# EasyEDA Pro project ProProject_SIMPLESLIME_ESP32_v2_2024-06-12-clean.epro

# Schematic Schematic1
Create Date: 2023-09-22; Page Name: P1; Project Name: SIMPLESLIME_ESP32_v2; Schematic Name: Schematic1; Update Date: 2024-02-03; Company: EasyEDA.com; Drawed: EasyEDA Pro; Page Size: A4; Part Number: JLCPCB-002; Reviewed: EasyEDA Pro; Version: V0.1
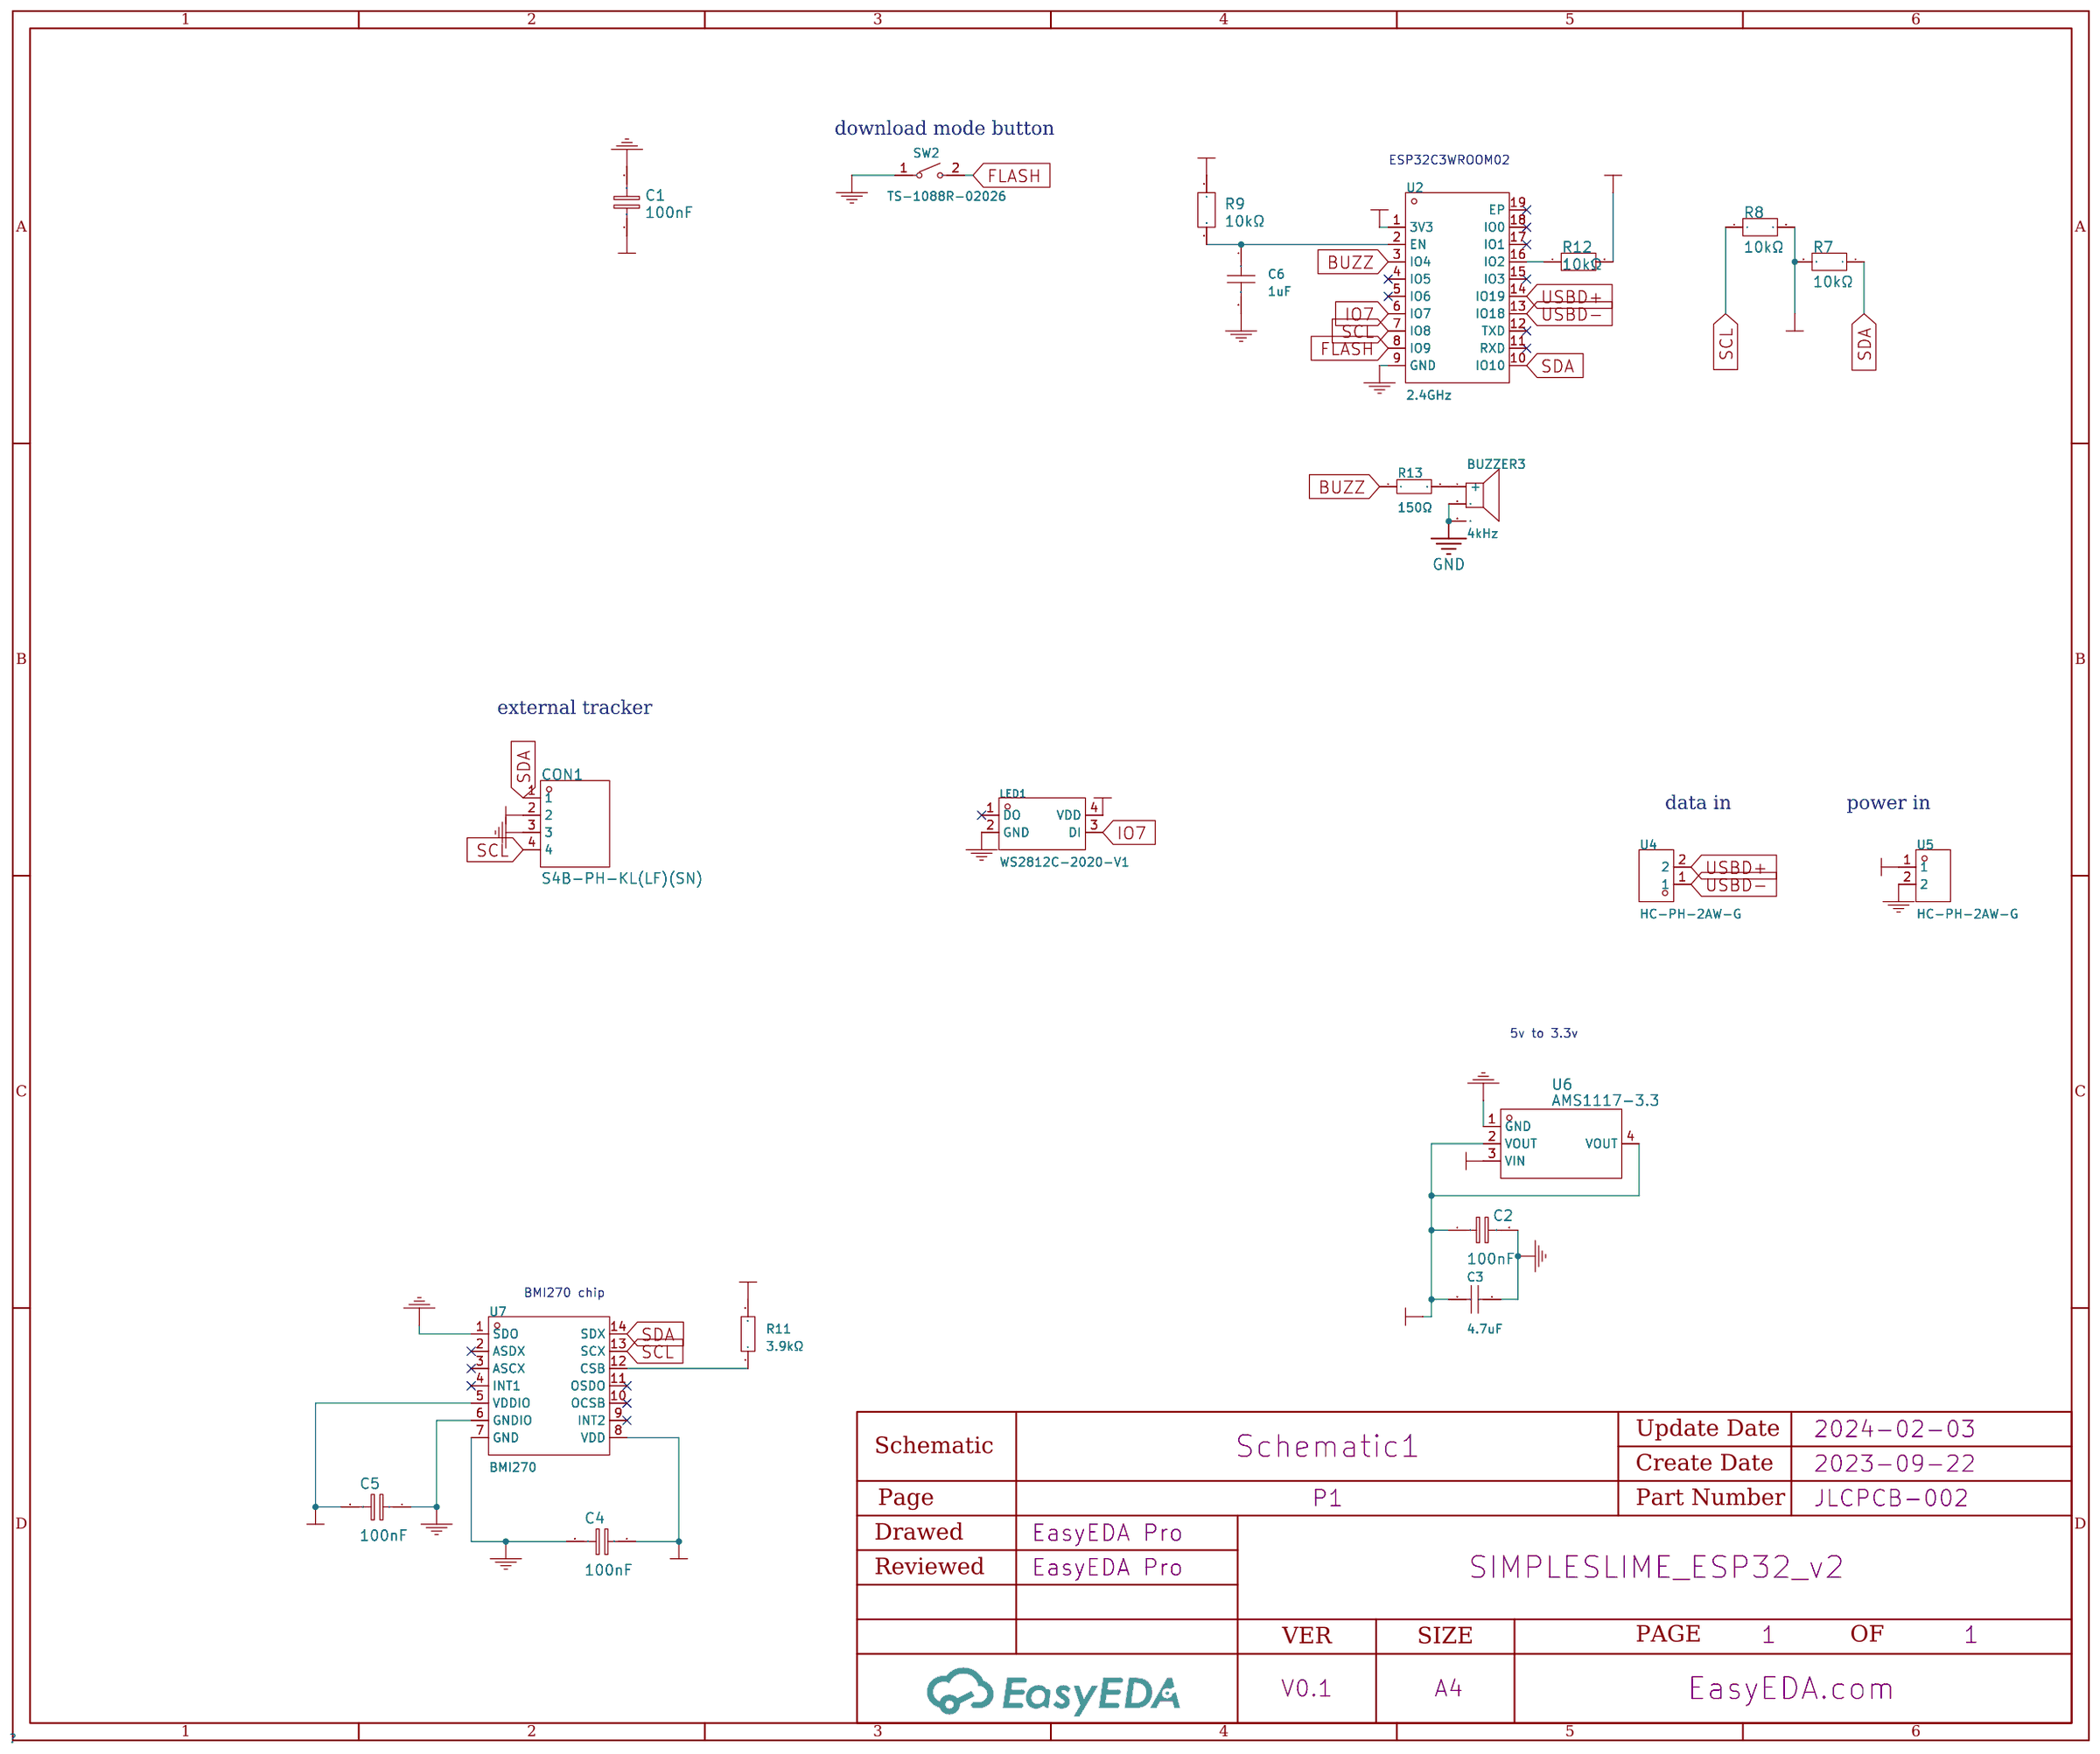
[diagram p0: schematic sheet]

## Parts
BUZZER3  4kHz  [BUZ-SMD_FST-5020]  (no BOM)
C1  100nF  [C0805]
C2  100nF  [C0805]
C3  4.7uF  [C0805]
C4  100nF  [C0805]
C5  100nF  [C0805]
C6  1uF  [C0805]
CON1  S4B-PH-KL(LF)(SN)  [CONN-TH_S4B-PH-KL-LF-SN]  (no BOM)
LED1  WS2812C-2020-V1  [LED-SMD_4P-L2.0-W2.0-TL_WS2812B-2020]  (no BOM)
R7  10kΩ  [R0805]
R8  10kΩ  [R0805]
R9  10kΩ  [R0805]
R11  3.9kΩ  [R0805]
R12  10kΩ  [R0805]
R13  150Ω  [R0805]  (no BOM)
SW2  TS-1088R-02026  [SW-SMD_L3.9-W3.0-P4.45]  (no BOM)
U2  2.4GHz  [BULETM-SMD_ESPRESSIF_ESP32-C3-WROOM-02-N4-4MB]  (no BOM)
U4  HC-PH-2AW-G  [CONN-TH_2P-P2.00_HC-PH-2AW-G]  (no BOM)
U5  HC-PH-2AW-G  [CONN-TH_2P-P2.00_HC-PH-2AW-G]  (no BOM)
U6  AMS1117-3.3  [SOT-223-3_L6.5-W3.4-P2.30-LS7.0-BR]
U7  BMI270  [LGA-14_L3.0-W2.5-P0.50-BR]

## Library data of the parts
BUZZER3 = FUET-5020_C391029: Oscillator Circuit:无源(外部驱动) Technology Type:电磁式 Operating Voltage:2V~4V Operating Voltage:2V~4V Frequency:4kHz Sound Pressure Level (SPL):75dB@3V,10cm Length:5mm Width:5mm Height:2.2mm; LCSC Part Name: 电压 3V 频率 4KHZ; Supplier Part: C391029; Manufacturer: FUET(福声科技); Manufacturer Part: FUET-5020; Supplier Footprint: SMD,5x5mm; JLCPCB Part Class: Extended Part; Datasheet: https://atta.szlcsc.com/upload/public/pdf/source/20191031/C391029_B1B88F702A53C2C8669EAD87D742EF64.pdf; Supplier: LCSC; Oscillator Circuit: 无源(外部驱动); Technology Type: 电磁式; Operating Voltage: 2V~4V; Sound Pressure Level (SPL): 75dB@3V,10cm; Length: 5mm; Width: 5mm; Height: 2.2mm
C1 = CL21B104KCFNNNE: Capacitance: Tolerance:±10% Tolerance:±10% Voltage Rated: Temperature Coefficient:; LCSC Part Name: 100nF ±10% 100V; Supplier Part: C28233; Manufacturer: SAMSUNG(三星); Supplier Footprint: 0805; JLCPCB Part Class: Basic Part; Datasheet: https://atta.szlcsc.com/upload/public/pdf/source/20160218/1457707763339.pdf; Supplier: LCSC; Tolerance: ±10%; Check: true
C2 C4 C5 = CL21B104KCFNNNE: Capacitance: Tolerance:±10% Tolerance:±10% Voltage Rated: Temperature Coefficient:; LCSC Part Name: 100nF ±10% 100V; Supplier Part: C28233; Manufacturer: SAMSUNG(三星); Supplier Footprint: 0805; JLCPCB Part Class: Basic Part; Datasheet: https://atta.szlcsc.com/upload/public/pdf/source/20160218/1457707763339.pdf; Supplier: LCSC; Tolerance: ±10%; link: https://item.szlcsc.com/373011.html; 3DModel: C0805_L2.0-W1.3-H1.3; Check: true
C3 = CL21A475KAQNNNE: Capacitance: Tolerance:±10% Tolerance:±10% Voltage Rated: Temperature Coefficient:; LCSC Part Name: 4.7uF ±10% 25V; Supplier Part: C1779; Manufacturer: SAMSUNG(三星); Supplier Footprint: 0805; JLCPCB Part Class: Basic Part; Datasheet: https://atta.szlcsc.com/upload/public/pdf/source/20160218/1457707763339.pdf; Supplier: LCSC; Tolerance: ±10%; Check: true
C6 = CL21B105KBFNNNE: Capacitance: Tolerance:±10% Tolerance:±10% Voltage Rated: Temperature Coefficient:; LCSC Part Name: 1uF ±10% 50V; Supplier Part: C28323; Manufacturer: SAMSUNG(三星); Supplier Footprint: 0805; JLCPCB Part Class: Basic Part; Datasheet: https://atta.szlcsc.com/upload/public/pdf/source/20160218/1457707763339.pdf; Supplier: LCSC; Tolerance: ±10%; Check: true
CON1 = S4B-PH-KL(LF)(SN): link: https://item.szlcsc.com/171616.html; Supplier: LCSC; Supplier Part: C160235; Manufacturer: JST Sales America; JLCPCB Part Class: Extended Part; Check: true
LED1 = WS2812C-2020-V1: Emitted Color:RGB Diode Configuration:- Lens Color:- Dominant Wavelength:624nm；520nm；467nm Dominant Wavelength:624nm；520nm；467nm Peak Wavelength:- Color Temperature:- Color Temperature:- Forward Current:- Power Dissipation:- Viewing Angle:- Mounting Sytle; LCSC Part Name: RGB三色 （注意防潮，请查阅规格书中对应具体内容）; Supplier Part: C2976072; Manufacturer: worldsemi; Supplier Footprint: SMD,2x2mm; JLCPCB Part Class: Extended Part; Datasheet: https://atta.szlcsc.com/upload/public/pdf/source/20220222/52A01000447F5320C9A8C3F34CEFDB81.pdf; Supplier: LCSC; Emitted Color: RGB; Dominant Wavelength: 624nm；520nm；467nm; Check: true
R7-R9 R12 = 0805W8F1002T5E: Type:Thick Film Resistors Resistance:10kΩ Tolerance:±1% Tolerance:±1% Power(Watts): Overload Voltage (Max): Temperature Coefficient:±100ppm/℃ Temperature Coefficient:±100ppm/℃ Operating Temperature Range:-55℃~+155℃ Operating Temperature Range:-55℃~+155℃; LCSC Part Name: 10kΩ ±1% 125mW 厚膜电阻; Supplier Part: C17414; Manufacturer: UNI-ROYAL(厚声); Supplier Footprint: 0805; JLCPCB Part Class: Basic Part; Datasheet: https://atta.szlcsc.com/upload/public/pdf/source/20200306/C422600_1E6D84923E4A46A82E41ADD87F860B5C.pdf; Supplier: LCSC; Type: Thick Film Resistors; Tolerance: ±1%; Temperature Coefficient: ±100ppm/℃; Operating Temperature Range: -55℃~+155℃; Check: true
R11 = 0805W8F3901T5E: Type:Thick Film Resistors Resistance:3.9kΩ Tolerance:±1% Tolerance:±1% Power(Watts): Overload Voltage (Max): Temperature Coefficient:±100ppm/℃ Temperature Coefficient:±100ppm/℃ Operating Temperature Range:-55℃~+155℃ Operating Temperature Range:-55℃~+155℃; LCSC Part Name: 3.9kΩ ±1% 125mW 厚膜电阻; Supplier Part: C17614; Manufacturer: UNI-ROYAL(厚声); Supplier Footprint: 0805; JLCPCB Part Class: Basic Part; Datasheet: https://atta.szlcsc.com/upload/public/pdf/source/20200306/C422600_1E6D84923E4A46A82E41ADD87F860B5C.pdf; Supplier: LCSC; Type: Thick Film Resistors; Tolerance: ±1%; Temperature Coefficient: ±100ppm/℃; Operating Temperature Range: -55℃~+155℃; Check: true
R13 = 0805W8F1500T5E: Type:Thick Film Resistors Resistance: Tolerance:±1% Tolerance:±1% Power(Watts): Overload Voltage (Max): Temperature Coefficient:±100ppm/℃ Temperature Coefficient:±100ppm/℃ Operating Temperature Range:-55℃~+155℃ Operating Temperature Range:-55℃~+155℃; LCSC Part Name: 150Ω ±1% 125mW 厚膜电阻; Supplier Part: C17471; Manufacturer: UNI-ROYAL(厚声); Supplier Footprint: 0805; JLCPCB Part Class: Basic Part; Datasheet: https://atta.szlcsc.com/upload/public/pdf/source/20200306/C422600_1E6D84923E4A46A82E41ADD87F860B5C.pdf; Supplier: LCSC; Type: Thick Film Resistors; Tolerance: ±1%; Temperature Coefficient: ±100ppm/℃; Operating Temperature Range: -55℃~+155℃
SW2 = TS-1088R-02026: Contact Current:50mA Voltage Rating (DC):12V Circuit:SPST Mounting Style:Brick nogging Actuator Style:Round Button With Lamp:- Mechanical Life:- Switch Length:3.9mm Switch Width:2.93mm Switch Height:2mm; LCSC Part Name: 3.9*2.93*2mm 立贴 轻触开关; Supplier Part: C455280; Manufacturer: XUNPU(讯普); Supplier Footprint: SMD,3x4mm; JLCPCB Part Class: Extended Part; Datasheet: https://atta.szlcsc.com/upload/public/pdf/source/20191118/C455280_718CC4284DAF75EEB0AC8229AE7E40C5.pdf; Supplier: LCSC; Contact Current: 50mA; Voltage Rating (DC): 12V; Circuit: SPST; Mounting Style: Brick nogging; Actuator Style: Round Button; Switch Length: 3.9mm; Switch Width: 2.93mm; Switch Height: 2mm; Check: true
U2 = ESP32-C3-WROOM-02-N4_C2934560: Frequency:2.4GHz Output Power:20.5dBm Output Power:20.5dBm Core Processor:ESP32-C3 Support Interface:I2C；GPIO；SPI；JTAG；UART；USB；I2S; LCSC Part Name: ESP32-C3-WROOM-02-N4; Supplier Part: C2934560; Manufacturer: ESPRESSIF(乐鑫); Manufacturer Part: ESP32-C3-WROOM-02-N4; Supplier Footprint: VFQFN-32-EP; JLCPCB Part Class: Extended Part; Datasheet: https://atta.szlcsc.com/upload/public/pdf/source/20220106/F07459EFFE1D7CBA94B4FB8A075146A6.pdf; Supplier: LCSC; Output Power: 20.5dBm; Core Processor: ESP32-C3; Support Interface: I2C；GPIO；SPI；JTAG；UART；USB；I2S; Check: true
U4 U5 = HC-PH-2AW-G: Supplier Part: C5342442; Manufacturer: HCTL(华灿天禄); Supplier Footprint: 弯插,P=2mm; Supplier: LCSC; Check: true
U6 = AMS1117-3.3: link: https://item.szlcsc.com/410724.html; 3DModel: SOT-223-4P_L6.5-W3.5-H1.6-LS7.0-P2.30; Supplier: LCSC; Manufacturer: AMS; Supplier Part: C6186; JLCPCB Part Class: Basic Part; Check: true
U7 = BMI270: Supplier Part: C2836813; Manufacturer: Bosch(博世); Supplier Footprint: LGA-14(2.5x3); JLCPCB Part Class: Extended Part; Datasheet: https://atta.szlcsc.com/upload/public/pdf/source/20210625/C2836813_35E1F3F92097F45A3828DF13DDBA01A5.pdf; Supplier: LCSC; Check: true

## Nets
+3V3: C1.1 C2.1 C3.2 C4.1 C5.2 CON1.2 R7.2 R8.2 R9.1 R11.2 R12.2 U2.1(3V3) U6.2(VOUT) U6.4(VOUT) U7.5(VDDIO) U7.8(VDD)
+5V: LED1.4(VDD) U5.1 U6.3(VIN)
GND: BUZZER3.2 BUZZER3.3 C1.2 C2.2 C3.1 C4.2 C5.1 C6.2 CON1.3 LED1.2(GND) SW2.1 U2.9(GND) U5.2 U6.1(GND) U7.1(SDO) U7.6(GNDIO) U7.7(GND)
BOOT: SW2.2 U2.8(IO9)
BUZZ: R13.1 U2.3(IO4)
IO7: LED1.3(DI) U2.6(IO7)
SCL: CON1.4 R8.1 U2.7(IO8) U7.13(SCX)
SDA: CON1.1 R7.1 U2.10(IO10) U7.14(SDX)
USBD+: U2.14(IO19) U4.2
USBD-: U2.13(IO18) U4.1
$1N2324: R11.1 U7.12(CSB)
$1N25463: R12.1 U2.16(IO2)
$1N25628: C6.1 R9.2 U2.2(EN)
$1N33257: BUZZER3.1(+) R13.2

Not connected (* = marked no-connect by the designer): LED1 1(DO)*; U2 4(IO5)* 5(IO6)* 11(RXD)* 12(TXD)* 15(IO3)* 17(IO1)* 18(IO0)* 19(EP)*; U7 2(ASDX)* 3(ASCX)* 4(INT1)* 9(INT2)* 10(OCSB)* 11(OSDO)*

## Notes on the sheet
- download mode button
- ESP32­C3­WROOM­02
- external tracker
- data in
- power in
- 5v to 3.3v
- BMI270 chip

# Schematic Schematic2

## Sheets
1 main: Create Date: 2023-09-23; Page Name: main; Project Name: SIMPLESLIME_ESP32; Schematic Name: Schematic2; Update Date: 2023-09-24; Company: EasyEDA.com; Drawed: EasyEDA Pro; Page Size: A4; Part Number: JLCPCB-002; Reviewed: EasyEDA Pro; Version: V0.1
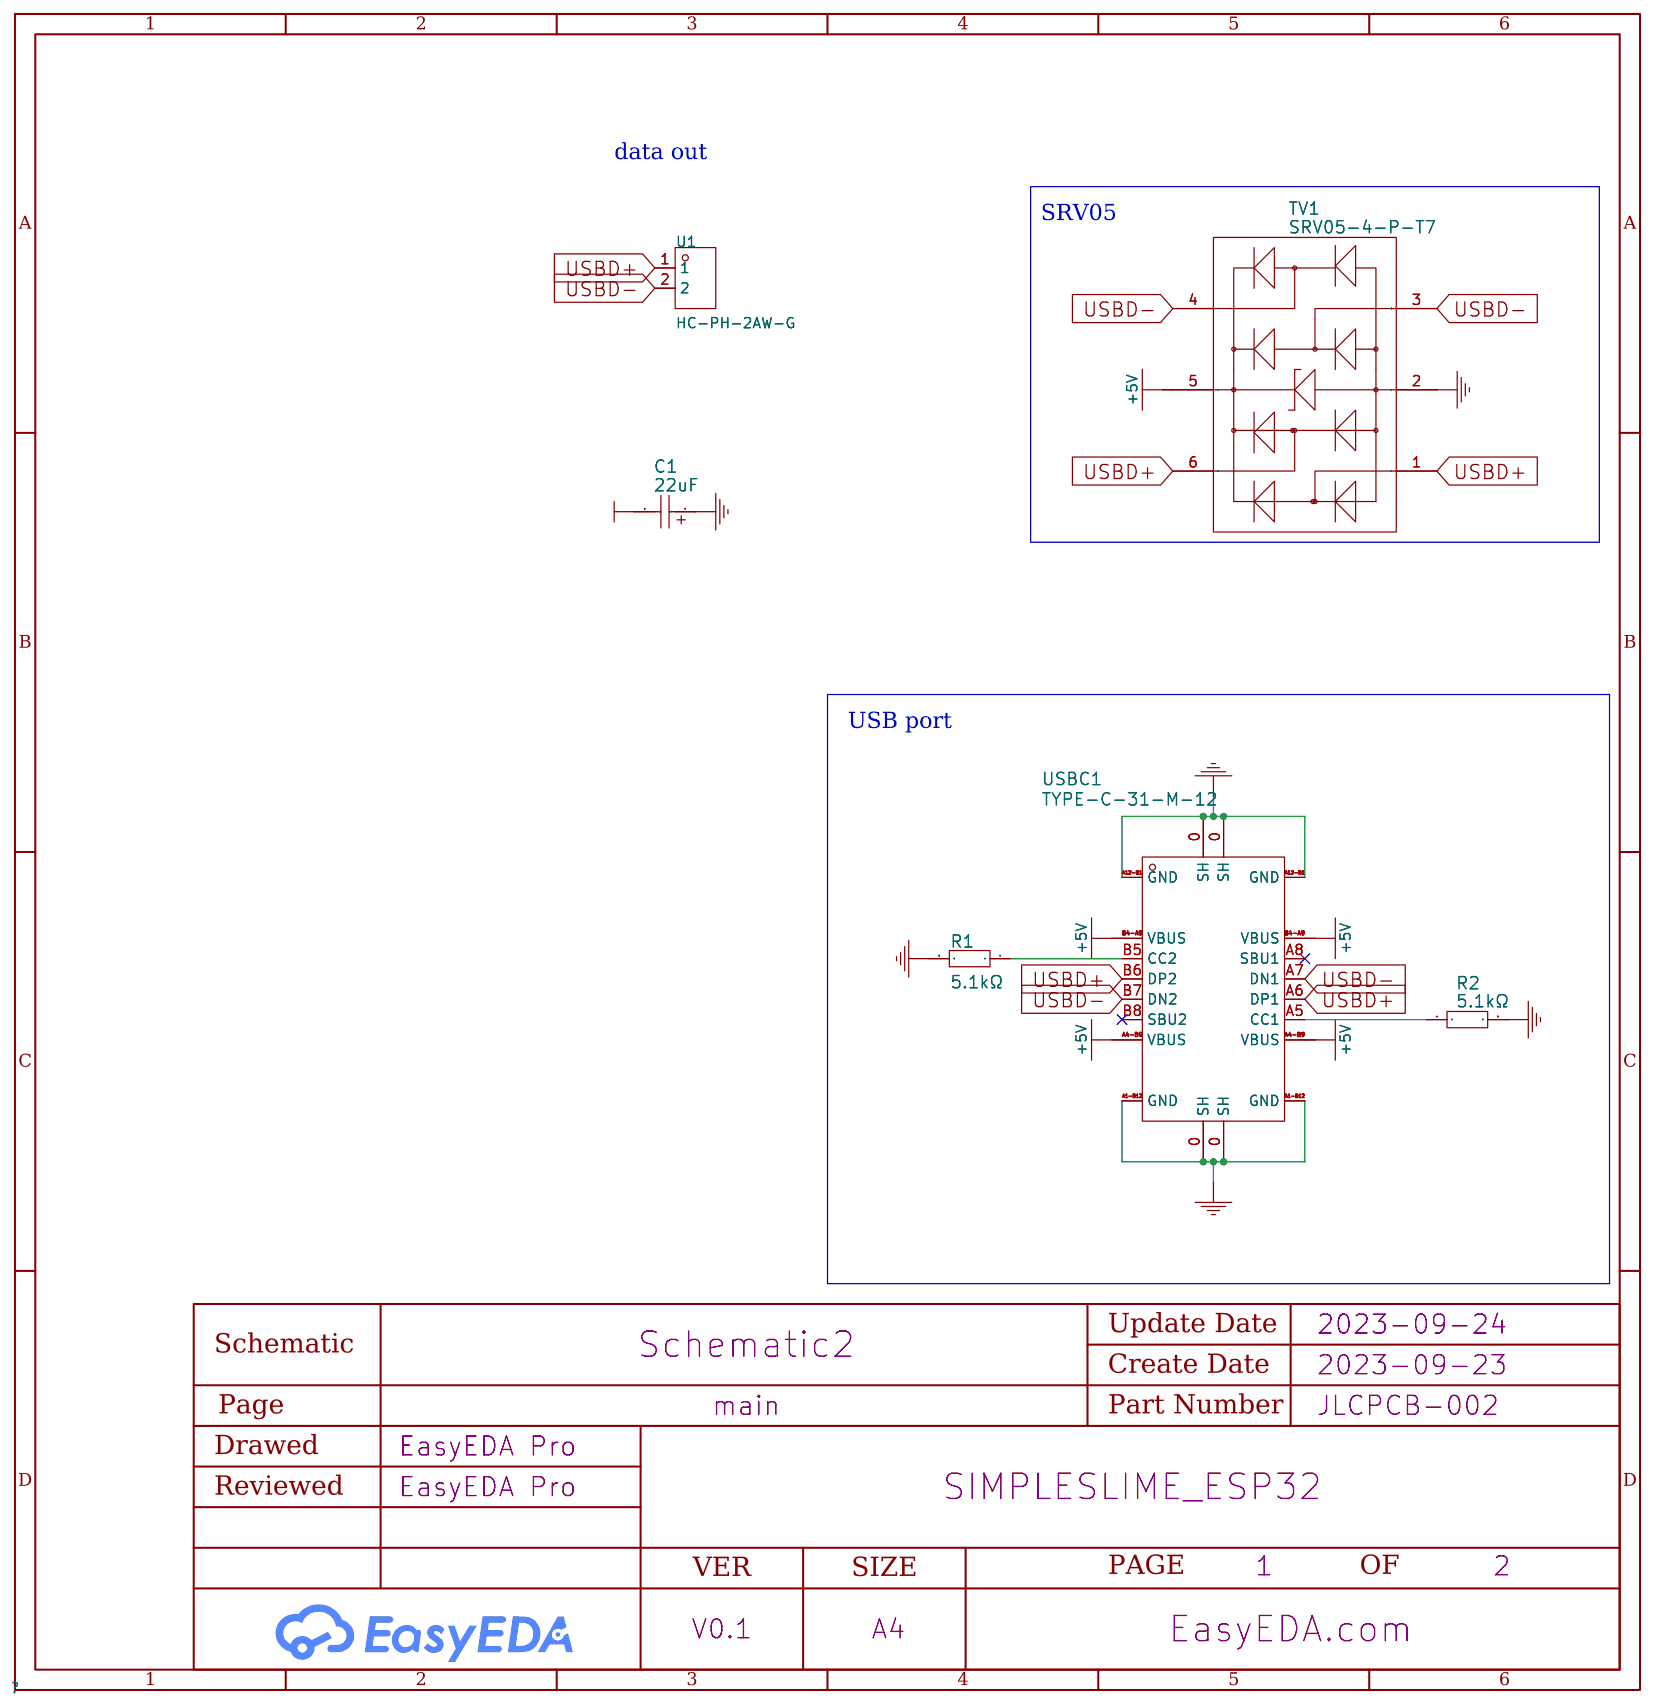
[diagram p1: main]
2 power: Page Name: power; Update Date: 2023-09-23
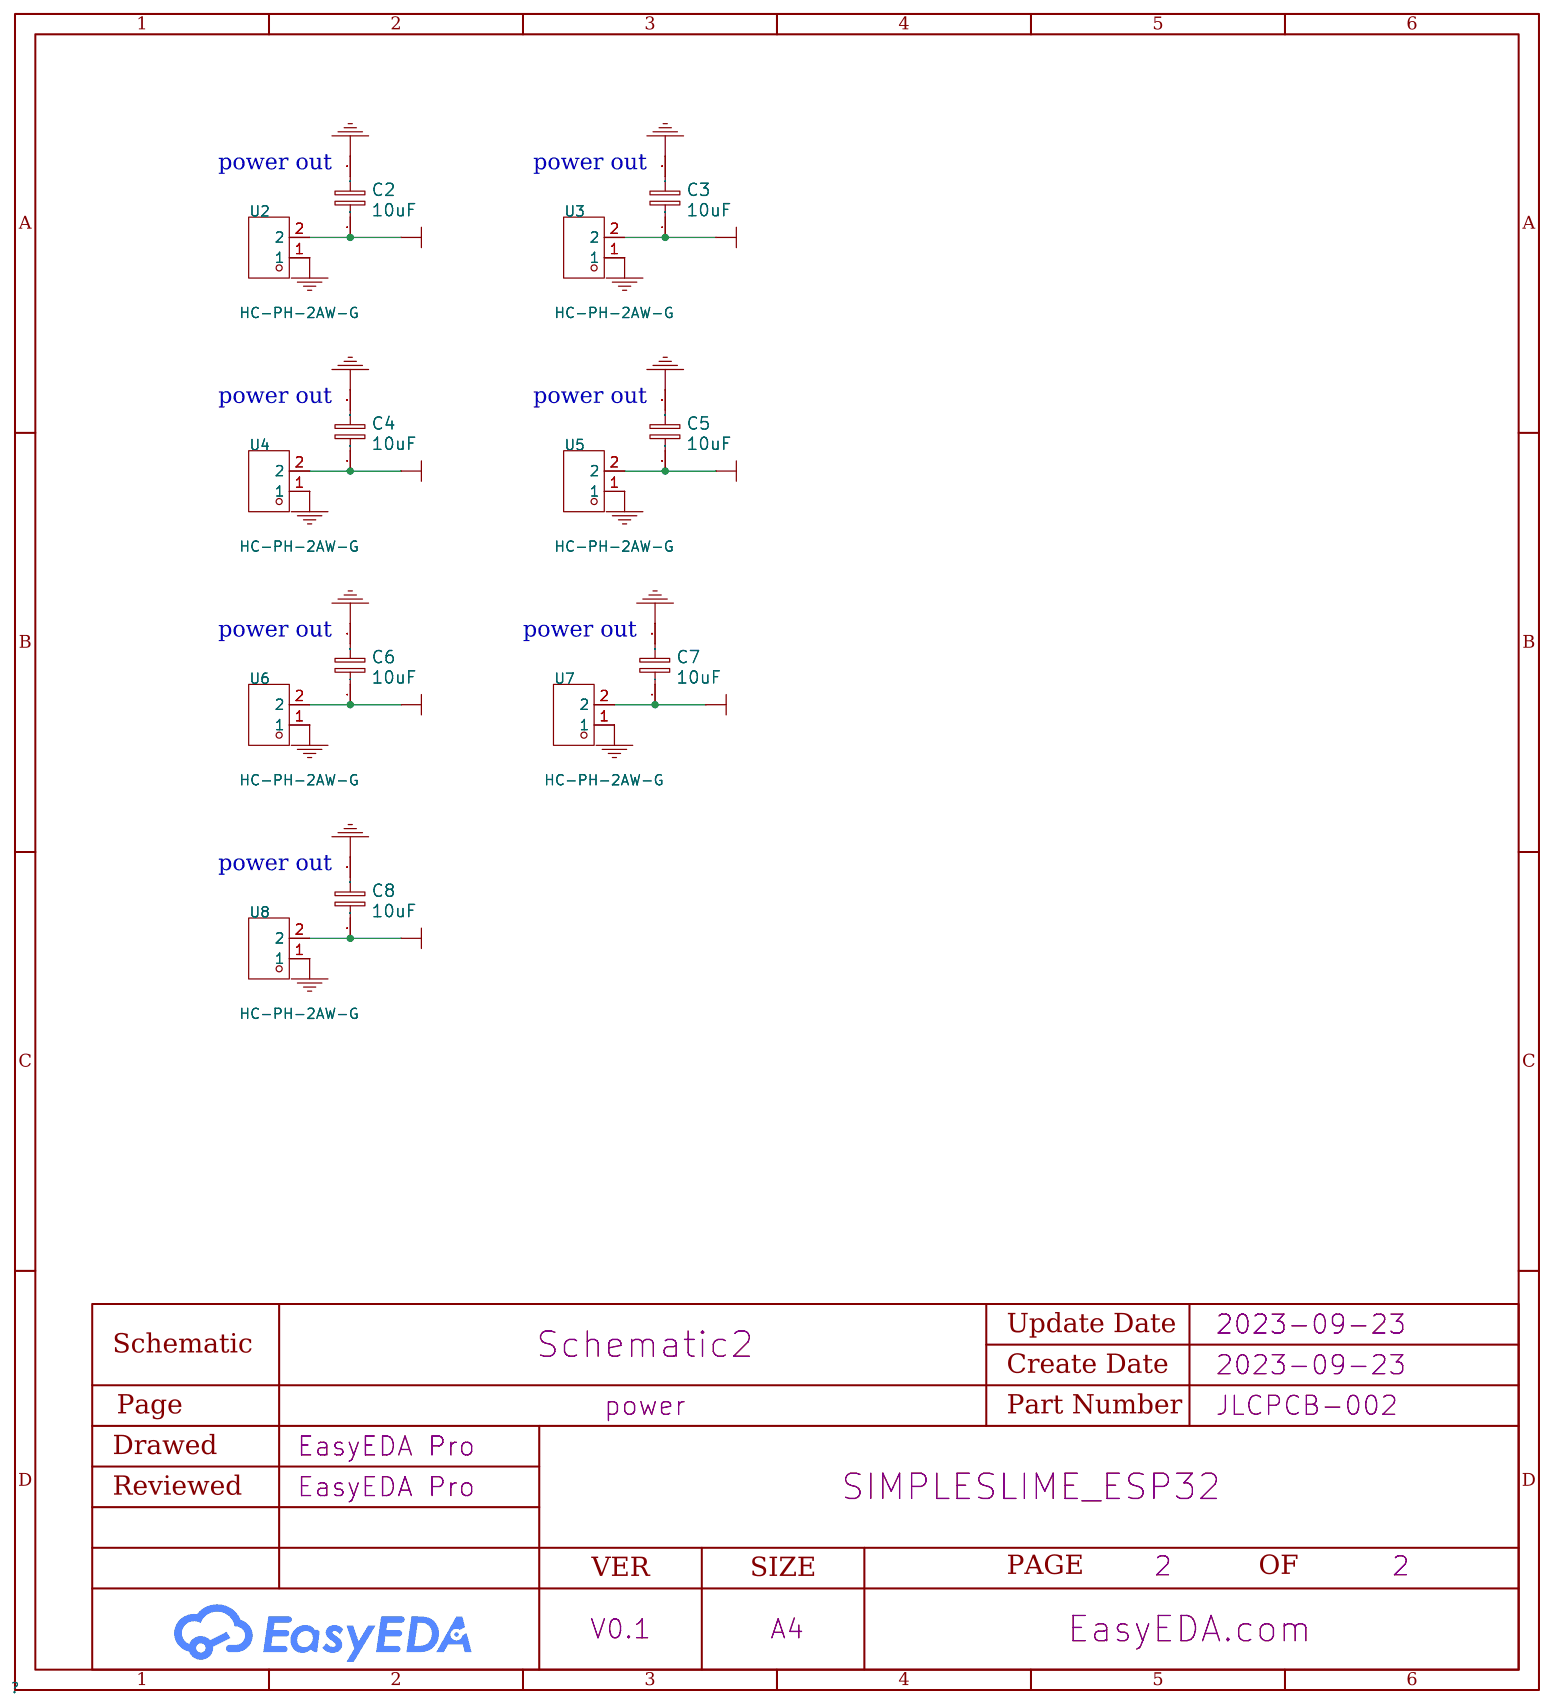
[diagram p2: power]

## Parts
sheet main
C1  22uF  [CAP-SMD_L3.5-W2.8-R-RD]
R1  5.1kΩ  [R0805]
R2  5.1kΩ  [R0805]
TV1  SRV05-4-P-T7  [SOT-23-6_L2.9-W1.6-P0.95-LS2.8-BR]
U1  HC-PH-2AW-G  [CONN-TH_2P-P2.00_HC-PH-2AW-G]
USBC1  TYPE-C-31-M-12  [C165948 MODIFIED]
sheet power
C2  10uF  [C0805]
C3  10uF  [C0805]
C4  10uF  [C0805]
C5  10uF  [C0805]
C6  10uF  [C0805]
C7  10uF  [C0805]
C8  10uF  [C0805]
U2  HC-PH-2AW-G  [CONN-TH_2P-P2.00_HC-PH-2AW-G]
U3  HC-PH-2AW-G  [CONN-TH_2P-P2.00_HC-PH-2AW-G]
U4  HC-PH-2AW-G  [CONN-TH_2P-P2.00_HC-PH-2AW-G]
U5  HC-PH-2AW-G  [CONN-TH_2P-P2.00_HC-PH-2AW-G]
U6  HC-PH-2AW-G  [CONN-TH_2P-P2.00_HC-PH-2AW-G]
U7  HC-PH-2AW-G  [CONN-TH_2P-P2.00_HC-PH-2AW-G]
U8  HC-PH-2AW-G  [CONN-TH_2P-P2.00_HC-PH-2AW-G]

## Library data of the parts
C1 = 22uF: link: https://atta.szlcsc.com/upload/public/pdf/source/20160107/1457707745471.pdf; 3DModel: CASE-B_L3.5-W2.8-H1.9; Supplier: LCSC; Manufacturer: Kyocera AVX; Manufacturer Part: TAJB226K016RNJ; Supplier Part: C8020; JLCPCB Part Class: Extended Part
R1 R2 = 5.1kΩ: link: https://item.szlcsc.com/142685.html; 3DModel: R0805_L2.0-W1.3-H0.6; Supplier: LCSC; Manufacturer: UniOhm; Manufacturer Part: 0805W8F5101T5E; Supplier Part: C27834; Resistance: 5.1K; JLCPCB Part Class: Basic Part
TV1 = SRV05-4-P-T7: link: https://item.szlcsc.com/169042.html; 3DModel: SOT-23-6_L2.9-W1.6-H1.5-LS2.8-P0.95; Supplier: LCSC; Manufacturer: PROTEK; Supplier Part: C85364; JLCPCB Part Class: Basic Part
U1-U8 = HC-PH-2AW-G: Supplier Part: C5342442; Manufacturer: HCTL(华灿天禄); Supplier Footprint: 弯插,P=2mm; Supplier: LCSC
USBC1 = TYPE-C-31-M-12: Supplier: LCSC; Supplier Part: C165948; Manufacturer: 韩国韩荣; JLCPCB Part Class: Extended Part
C2-C8 = 10uF: link: https://item.szlcsc.com/373011.html; 3DModel: C0805_L2.0-W1.3-H1.3

## Nets
+5V: C1.2 C2.1 C3.1 C4.1 C5.1 C6.1 C7.1 C8.1 TV1.5 U2.2 U3.2 U4.2 U5.2 U6.2 U7.2 U8.2 USBC1.A4-B9(VBUS) USBC1.B4-A9(VBUS)
GND: C1.1 C2.2 C3.2 C4.2 C5.2 C6.2 C7.2 C8.2 R1.2 R2.2 TV1.2 U2.1 U3.1 U4.1 U5.1 U6.1 U7.1 U8.1 USBC1.0(SH) USBC1.A1-B12(GND) USBC1.A12-B1(GND)
USBD+: TV1.1 TV1.6 U1.1 USBC1.A6(DP1) USBC1.B6(DP2)
USBD-: TV1.3 TV1.4 U1.2 USBC1.A7(DN1) USBC1.B7(DN2)
$1N557: R2.1 USBC1.A5(CC1)
$1N558: R1.1 USBC1.B5(CC2)

Not connected (* = marked no-connect by the designer): USBC1 A8(SBU1)* B8(SBU2)*

## Notes on the sheets
sheet 1
- data out
- SRV05
- USB port
sheet 2
- power out
- power out
- power out
- power out
- power out
- power out
- power out

# Board PCB1
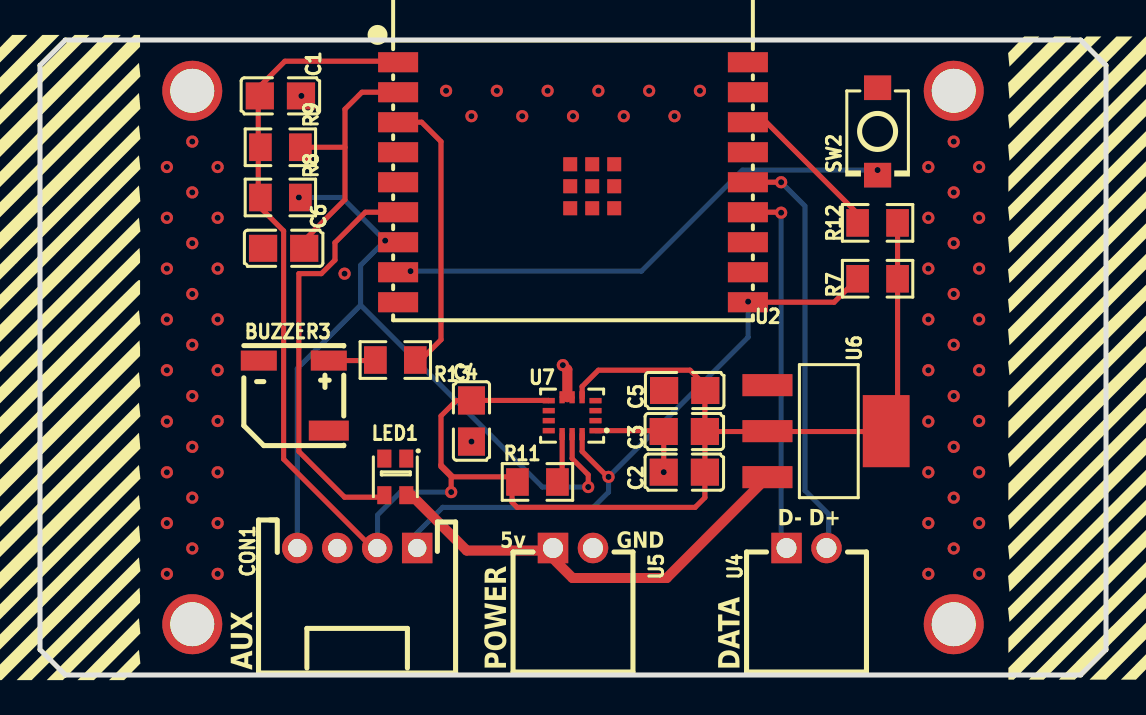
[diagram p3: board, top side]
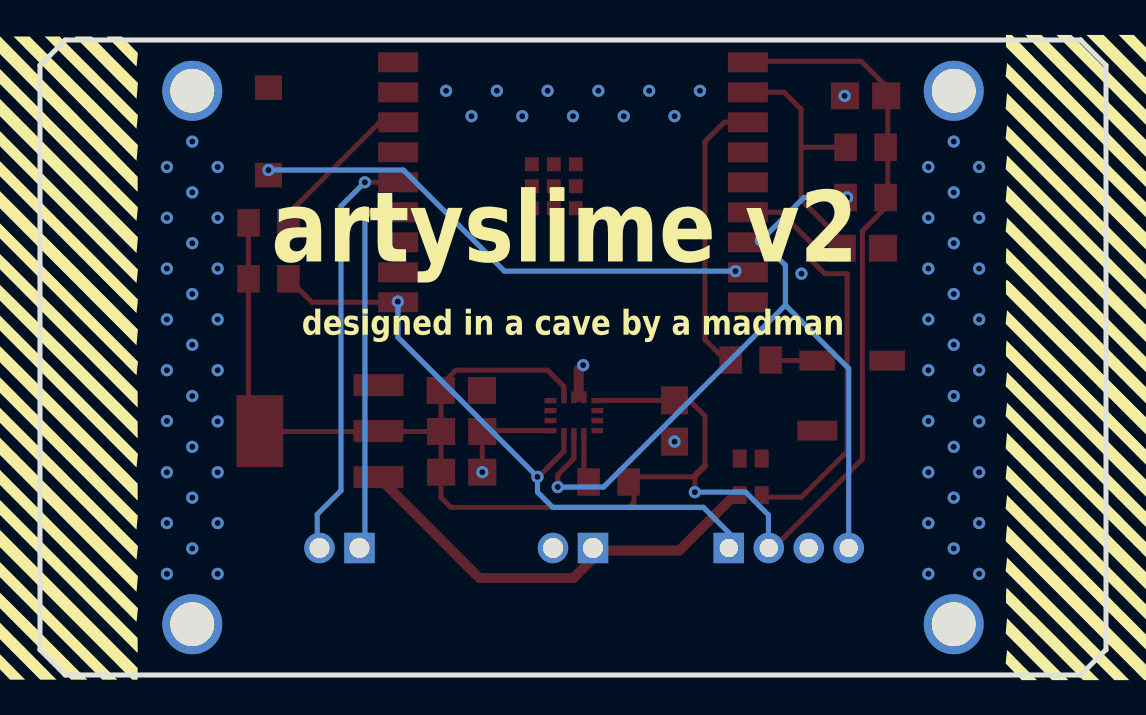
[diagram p4: board, bottom side, seen from below]

Outline 53.34 x 31.75 mm; copper layers: Top Layer, Bottom Layer. Coordinates in mm from the lower left corner of the outline.
Outline path: 0,30.48 0,1.27 1.27,0 52.07,0 53.34,1.27 53.34,30.48 52.07,31.75 1.27,31.75 0,30.48
Stack: Top Layer 0.035mm / Dielectric1 1.51mm FR4 er 4.5 / Bottom Layer 0.035mm

## Design rules (mm)
template: JLCPCB Capability(Two Layers Board)
spacing copperThickness1oz (default): track to track 0.102, other pairs 0.152 to 0.3
spacing copperThickness2oz: track to track 0.203, other pairs 0.152 to 0.3
track width copperThickness1oz (default): min 0.127, default 0.254, max 2.54
track width copperThickness2oz: min 0.203, default 0.254, max 2.54
differential pair differentialPair (default): width min 0.127, default 0.254, max 2.54; gap min 0.152, default 0.152
via viaSize (default): diameter min 0.5, default 0.61, max 10; hole min 0.3, default 0.305, max 6.3

## Placement (name value [footprint] x y rotation side)
BUZZER3  4kHz  [BUZ-SMD_FST-5020]  12.7 13.97 180 top
C1  100nF  [C0805]  12.03 28.96 0 top
C2  100nF  [C0805]  32.24 10.14 180 top
C3  4.7uF  [C0805]  32.24 12.17 0 top
C4  100nF  [C0805]  21.59 12.7 270 top
C5  100nF  [C0805]  32.26 14.22 0 top
C6  1uF  [C0805]  12.19 21.34 180 top
CON1  S4B-PH-KL(LF)(SN)  [CONN-TH_S4B-PH-KL-LF-SN]  15.88 6.35 0 top
LED1  WS2812C-2020-V1  [LED-SMD_4P-L2.0-W2.0-TL_WS2812B-2020]  17.78 9.91 270 top
NOREF  -  [Pad_e227]  7.62 2.54 0 top
NOREF#2  -  [Pad_e230]  45.72 29.21 0 top
NOREF#3  -  [Pad_e228]  45.72 2.54 0 top
NOREF#4  -  [Pad_e229]  7.62 29.21 0 top
R7  10kΩ  [R0805]  41.91 19.81 0 top
R8  10kΩ  [R0805]  12.03 23.88 180 top
R9  10kΩ  [R0805]  12.03 26.39 0 top
R11  3.9kΩ  [R0805]  24.89 9.65 180 top
R12  10kΩ  [R0805]  41.91 22.61 0 top
R13  150Ω  [R0805]  17.78 15.75 180 top
SW2  TS-1088R-02026  [SW-SMD_L3.9-W3.0-P4.45]  41.91 27.18 270 top
U2  2.4GHz  [BULETM-SMD_ESPRESSIF_ESP32-C3-WROOM-02-N4-4MB]  26.67 24.64 0 top
U4  HC-PH-2AW-G  [CONN-TH_2P-P2.00_HC-PH-2AW-G]  38.35 6.35 0 top
U5  HC-PH-2AW-G  [CONN-TH_2P-P2.00_HC-PH-2AW-G]  26.67 6.35 0 top
U6  AMS1117-3.3  [SOT-223-3_L6.5-W3.4-P2.30-LS7.0-BR]  39.37 12.19 180 top
U7  BMI270  [LGA-14_L3.0-W2.5-P0.50-BR]  26.63 12.97 0 top

## Footprints (pads in the part's own frame, mm; a bottom-side part is the same pattern mirrored in y, then rotated)
BULETM-SMD_ESPRESSIF_ESP32-C3-WROOM-02-N4-4MB
  rect 2x1 smd: 1(-8.75,6) 2(-8.75,4.5) 3(-8.75,3) 4(-8.75,1.5) 5(-8.75,0) 6(-8.75,-1.5) 7(-8.75,-3) 8(-8.75,-4.5) 9(-8.75,-6) 10(8.75,-6) 11(8.75,-4.5) 12(8.75,-3) 13(8.75,-1.5) 14(8.75,0) 15(8.75,1.5) 16(8.75,3) 17(8.75,4.5) 18(8.75,6)
  rect 0.7x0.7 smd: 19(-0.14,0.9) 19(-0.14,-0.2) 19(-0.14,-1.3) 19(0.96,0.9) 19(0.96,-0.2) 19(0.96,-1.3) 19(2.06,0.9) 19(2.06,-0.2) 19(2.06,-1.3)
BUZ-SMD_FST-5020
  rect 1.8x1 smd: 1(-1.75,-1.75) 2(1.75,-1.75)
  rect 2x1 smd: 3(-1.75,1.75)
C0805
  rect 1.41x1.35 smd: 1(-1.03,0) 2(1.03,0)
CONN-TH_2P-P2.00_HC-PH-2AW-G
  rect 1.524x1.524 hole 1: 1(-1,0)
  round 1.524 hole 1: 2(1,0)
CONN-TH_S4B-PH-KL-LF-SN
  rect 1.524x1.524 hole 0.914: 1(3,0)
  round 1.524 hole 0.914: 2(1,0) 3(-1,0) 4(-3,0)
LED-SMD_4P-L2.0-W2.0-TL_WS2812B-2020
  rect 0.9x0.7 smd: 1(-0.915,0.55) 2(-0.915,-0.55) 3(0.915,-0.55) 4(0.915,0.55)
LGA-14_L3.0-W2.5-P0.50-BR
  rect 0.6x0.27 smd: 1(1.17,-0.75) 2(1.17,-0.25) 3(1.17,0.25) 4(1.17,0.75) 8(-1.17,0.75) 9(-1.17,0.25) 10(-1.17,-0.25) 11(-1.17,-0.75)
  rect 0.27x0.6 smd: 5(0.5,0.92) 6(0,0.92) 7(-0.5,0.92) 12(-0.5,-0.92) 13(0,-0.92) 14(0.5,-0.92)
Pad_e227
  round 3 hole 2.2: 1(0,0)
Pad_e228
  round 3 hole 2.2: 1(0,0)
Pad_e229
  round 3 hole 2.2: 1(0,0)
Pad_e230
  round 3 hole 2.2: 1(0,0)
R0805
  rect 1.133x1.377 smd: 1(-1,0) 2(1,0)
SOT-223-3_L6.5-W3.4-P2.30-LS7.0-BR
  rect 2.5x1.1 smd: 1(2.97,-2.3) 2(2.97,0) 3(2.97,2.3)
  rect 2.34x3.6 smd: 4(-2.97,0)
SW-SMD_L3.9-W3.0-P4.45
  rect 1.23x1.36 smd: 1(-2.185,0) 2(2.185,0)

## Nets
As in the schematic, except:
GND: BUZZER3.2 BUZZER3.3 C1.2 C2.2 C3.1 C4.2 C5.1 C6.2 CON1.3 LED1.2 NOREF.1 NOREF#2.1 NOREF#3.1 NOREF#4.1 SW2.1 U2.9 U5.2 U6.1 U7.1 U7.6 U7.7

Pads without a net: LED1 1; U2 4 5 11 12 15 17 18 19; U7 2 3 4 9 10 11

## Via types
v1: diameter 0.61, hole 0.305, Top Layer to Bottom Layer, 80 vias

## Routing (per net, layer and track width the routed paths; a pad name or vN(x,y) marks a point on that pad's centre or on a via; arc(x,y) is an arc through that point)
+3V3: length 96.6
  Top Layer w0.254: 20.07,10.51 20.07,10.41 20.57,9.91 v1(20.57,9.14) ; 20.07,10.51 20.07,12.95 20.83,13.72 21.58,13.72 C4.1 25.44,13.73 U7.8 ; 20.07,10.51 20.67,9.91 23.62,9.91 23.62,8.64 23.88,8.38 32.78,8.38 33.27,8.87 C2.1 C3.2 ; CON1.2 16.64,6.35 12.19,10.8 12.19,22.21 10.92,23.48 10.92,29.36 12.25,30.69 17.87,30.69 U2.1 ; C3.2 36.38,12.17 ; C3.2 33.27,14.21 C5.2 33.29,14.48 32.53,15.24 27.94,15.24 27.13,14.43 U7.5 ; 36.38,12.17 42.32,12.17 U6.4 42.91,12.76 R7.2 R12.2 ; 36.38,12.17 U6.2
  Bottom Layer w0.254: v1(20.57,9.14) 18.03,9.14 16.89,8 16.89,6.98 16.37,6.46
+5V: length 22.3
  Top Layer w0.5: U6.3 31.36,4.85 26.65,4.85 25.27,6.22 ; 25.27,6.22 21.35,6.22 18.58,8.99 LED1.4 ; 25.27,6.22 25.67,6.22
GND: length 7.7
  Top Layer w0.254: U7.6 U7.7 ; v1(31.21,10.14) C3.1 31.17,12.22 U7.1
  Top Layer w0.5: 26.39,13.89 26.39,15.27 v1(26.16,15.49)
  vias: v1(6.35,25.4) v1(6.35,22.86) v1(6.35,20.32) v1(6.35,17.78) v1(6.35,15.24) v1(6.35,12.68) v1(6.35,10.14) v1(6.35,7.6) v1(6.35,5.06) v1(7.62,26.67) v1(7.62,24.13) v1(7.62,21.59) v1(7.62,19.05) v1(7.62,16.51) v1(7.62,13.95) v1(7.62,11.41) v1(7.62,8.87) v1(7.62,6.33) v1(8.89,25.4) v1(8.89,22.86) v1(8.89,20.32) v1(8.89,17.78) v1(8.89,15.24) v1(8.89,12.7) v1(8.89,10.14) v1(8.89,7.6) v1(8.89,5.06) v1(13.08,28.96) v1(15.24,20.07) v1(20.32,29.21) v1(21.59,27.94) v1(21.59,11.67) v1(22.86,29.21) v1(24.13,27.94) v1(25.4,29.21) v1(26.67,27.94) v1(27.94,29.21) v1(29.21,27.94) v1(30.48,29.21) v1(31.75,27.94) v1(33.02,29.21) v1(44.45,25.4) v1(44.45,22.86) v1(44.45,20.32) v1(44.45,17.78) v1(44.45,15.24) v1(44.45,12.68) v1(44.45,10.14) v1(44.45,7.6) v1(44.45,5.06) v1(45.72,26.67) v1(45.72,24.13) v1(45.72,21.59) v1(45.72,19.05) v1(45.72,16.51) v1(45.72,13.95) v1(45.72,11.41) v1(45.72,8.87) v1(45.72,6.33) v1(46.99,25.4) v1(46.99,22.86) v1(46.99,20.32) v1(46.99,17.78) v1(46.99,15.24) v1(46.99,12.7) v1(46.99,10.14) v1(46.99,7.6) v1(46.99,5.06)
BOOT: length 25.5
  Bottom Layer w0.254: v1(41.91,25.25) 35.15,25.25 30.1,20.19 v1(18.54,20.19)
BUZZ: length 14.2
  Top Layer w0.254: R13.1 19.05,15.75 20.07,16.76 20.07,26.67 19.1,27.64 U2.3
IO7: length 20.9
  Top Layer w0.254: LED1.3 17.13,8.89 15.24,8.89 12.95,11.18 12.95,20.07 14.08,20.07 14.76,20.75 14.76,21.62 16.28,23.14 U2.6
SCL: length 40.5
  Top Layer w0.254: U7.13 26.63,10.82 27.43,10.01 v1(27.43,9.4)
  Bottom Layer w0.254: v1(12.95,23.88) 15.11,23.88 v1(17.27,21.72) 16.04,20.49 16.04,18.49 ; v1(27.43,9.4) 25.14,9.4 16.04,18.49 ; 16.04,18.49 12.88,15.32 CON1.4
SDA: length 32.6
  Top Layer w0.254: U7.14 27.13,11.18 28.4,9.91 v1(28.45,9.91) ; R7.1 39.74,18.64 U2.10
  Bottom Layer w0.254: CON1.1 18.49,6.73 20.14,8.38 27.69,8.38 28.45,9.14 v1(28.45,9.91) 35.43,16.89 v1(35.43,18.67)
USBD+: length 21.2
  Top Layer w0.254: v1(37.08,24.64) U2.14
  Bottom Layer w0.254: v1(37.08,24.64) 38.28,23.44 38.28,9.22 39.46,8.03 39.46,6.24 U4.2
USBD-: length 18.5
  Top Layer w0.254: U2.13 37.06,23.14 v1(37.08,23.11)
  Bottom Layer w0.254: U4.1 37.08,6.62 v1(37.08,23.11)
$1N2324: length 2.2
  Top Layer w0.254: 25.85,9.92 26.13,10.2 U7.12
$1N25463: length 7.8
  Top Layer w0.254: R12.1 40.91,23.07 36.34,27.64 U2.16
$1N25628: length 13.7
  Top Layer w0.254: 12.71,21.34 12.83,21.34 15.26,23.77 15.26,26.39 ; 15.26,26.39 15.26,28.29 16.11,29.14 U2.2 ; 15.26,26.39 12.65,26.39
$1N33257: length 2.3
  Top Layer w0.254: R13.2 16.75,15.72 BUZZER3.1

## Copper pours and planes (outline as drawn; the poured copper is in the pictures)
GND on Top Layer: -0.13,-0.13 53.34,-0.13 53.34,31.75 -0.13,31.75
GND on Bottom Layer: 0,0 53.34,0 53.34,31.75 0,31.75

## Text on the board
Bottom Silkscreen Layer: designed in a cave by a madman | artyslime v2
Top Silkscreen Layer: 5v | GND | D- D+ | POWER | AUX | DATA

# Board PCB2
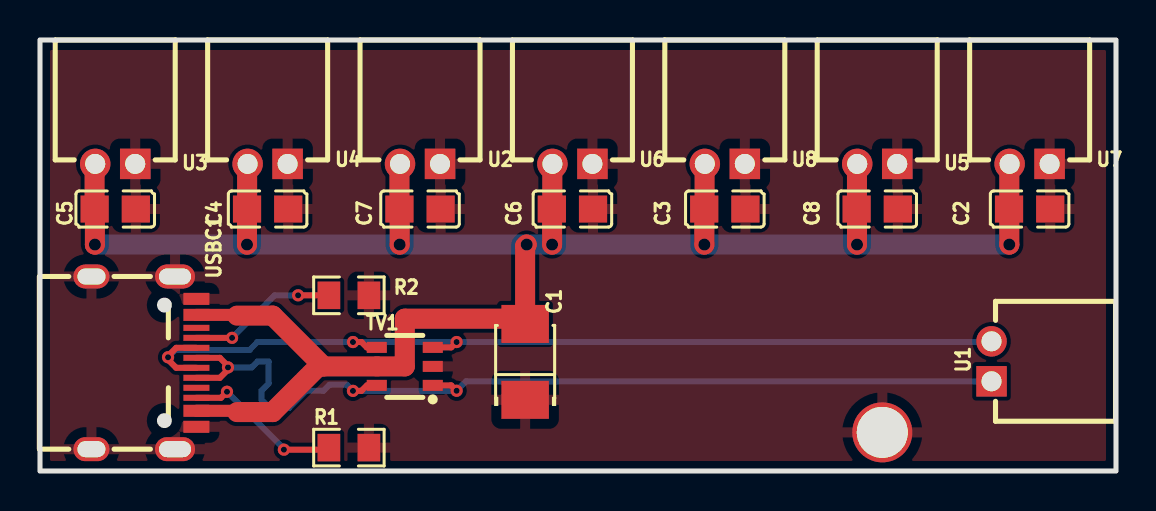
[diagram p5: board, top side]
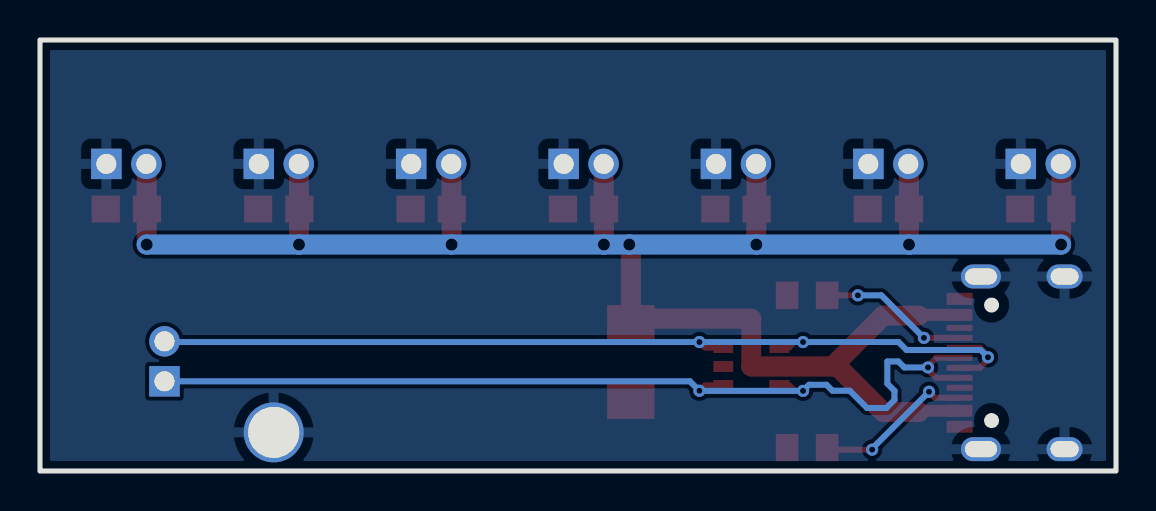
[diagram p6: board, bottom side, seen from below]

Outline 53.8 x 21.57 mm; copper layers: Top Layer, Bottom Layer. Coordinates in mm from the lower left corner of the outline.
Outline path: rectangle 53.8,21.57 0,0
Stack: Top Layer 0.035mm / Dielectric1 1.51mm FR4 er 4.5 / Bottom Layer 0.035mm

## Design rules (mm)
template: Custom Config
spacing copperThickness1oz (default): track to track 0.102, other pairs 0.152 to 2.54
spacing copperThickness2oz: track to track 0.203, other pairs 0.152 to 0.3
track width copperThickness1oz (default): min 0.127, default 0.254, max 2.54
track width copperThickness2oz: min 0.203, default 0.254, max 2.54
differential pair differentialPair (default): width min 0.127, default 0.254, max 2.54; gap min 0.152, default 0.152
via viaSize (default): diameter min 0.5, default 0.61, max 10; hole min 0.3, default 0.305, max 6.3

## Placement (name value [footprint] x y rotation side)
C1  22uF  [CAP-SMD_L3.5-W2.8-R-RD]  24.26 5.46 270 top
C2  10uF  [C0805]  49.48 13.11 0 top
C3  10uF  [C0805]  34.24 13.11 0 top
C4  10uF  [C0805]  11.38 13.11 0 top
C5  10uF  [C0805]  3.76 13.11 0 top
C6  10uF  [C0805]  26.62 13.11 0 top
C7  10uF  [C0805]  19 13.11 0 top
C8  10uF  [C0805]  41.86 13.11 0 top
NOREF  -  [Pad_e3640]  42.12 1.93 270 top
R1  5.1kΩ  [R0805]  15.45 1.17 0 top
R2  5.1kΩ  [R0805]  15.45 8.79 0 top
TV1  SRV05-4-P-T7  [SOT-23-6_L2.9-W1.6-P0.95-LS2.8-BR]  18.24 5.23 0 top
U1  HC-PH-2AW-G  [CONN-TH_2P-P2.00_HC-PH-2AW-G]  47.58 5.49 90 top
U2  HC-PH-2AW-G  [CONN-TH_2P-P2.00_HC-PH-2AW-G]  19 15.37 180 top
U3  HC-PH-2AW-G  [CONN-TH_2P-P2.00_HC-PH-2AW-G]  3.76 15.37 180 top
U4  HC-PH-2AW-G  [CONN-TH_2P-P2.00_HC-PH-2AW-G]  11.38 15.37 180 top
U5  HC-PH-2AW-G  [CONN-TH_2P-P2.00_HC-PH-2AW-G]  41.86 15.37 180 top
U6  HC-PH-2AW-G  [CONN-TH_2P-P2.00_HC-PH-2AW-G]  26.62 15.37 180 top
U7  HC-PH-2AW-G  [CONN-TH_2P-P2.00_HC-PH-2AW-G]  49.48 15.37 180 top
U8  HC-PH-2AW-G  [CONN-TH_2P-P2.00_HC-PH-2AW-G]  34.24 15.37 180 top
USBC1  TYPE-C-31-M-12  [C165948 MODIFIED]  4.21 4.65 270 top

## Footprints (pads in the part's own frame, mm; a bottom-side part is the same pattern mirrored in y, then rotated)
C0805
  rect 1.41x1.35 smd: 1(-1.03,0) 2(1.03,0)
C165948 MODIFIED
  oval 1.2x1.8 hole 0.8x1.4: 0(-5.08,-1.64) 1(3.56,-1.64)
  oval 1.2x2 hole 0.8x1.6: 2(3.56,2.54) 3(-5.08,2.54)
  rect 0.6x1.3 smd: A1-B12(-3.96,3.607) A4-B9(-3.16,3.607) A12-B1(2.44,3.607) B4-A9(1.64,3.607)
  rect 0.3x1.3 smd: A5(-2.01,3.607) A6(-1.01,3.607) A7(-0.51,3.607) A8(0.489,3.608) B5(0.99,3.607) B6(-0.01,3.607) B7(-1.51,3.607) B8(-2.51,3.608)
CAP-SMD_L3.5-W2.8-R-RD
  rect 1.9x2.376 smd: 1(1.899,0) 2(-1.899,0)
CONN-TH_2P-P2.00_HC-PH-2AW-G
  rect 1.524x1.524 hole 1: 1(-1,0)
  round 1.524 hole 1: 2(1,0)
Pad_e3640
  round 3 hole 2.55: 1(0,0)
R0805
  rect 1.133x1.377 smd: 1(-1,0) 2(1,0)
SOT-23-6_L2.9-W1.6-P0.95-LS2.8-BR
  rect 1x0.55 smd: 1(1.4,-0.95) 2(1.4,0) 3(1.4,0.95) 4(-1.4,0.95) 5(-1.4,0) 6(-1.4,-0.95)

## Nets
As in the schematic, except:
GND: C1.1 C2.2 C3.2 C4.2 C5.2 C6.2 C7.2 C8.2 NOREF.1 R1.2 R2.2 TV1.2 U2.1 U3.1 U4.1 U5.1 U6.1 U7.1 U8.1 USBC1.0 USBC1.1 USBC1.2 USBC1.3 USBC1.A1-B12 USBC1.A12-B1

Pads without a net: USBC1 A8 B8

## Via types
v1: diameter 0.61, hole 0.305, Top Layer to Bottom Layer, 10 vias
v2: diameter 1, hole 0.6, Top Layer to Bottom Layer, 8 vias

## Routing (per net, layer and track width the routed paths; a pad name or vN(x,y) marks a point on that pad's centre or on a via; arc(x,y) is an arc through that point)
+5V: length 105.4
  Top Layer w0.6: 9.86,2.95 9.79,3.01 USBC1.B4-A9 ; USBC1.A4-B9 9.82,7.81 9.86,7.77
  Top Layer w1: v2(48.47,11.33) 48.47,13.09 ; 48.47,13.09 48.47,15.35 U7.2 ; 48.47,13.09 C2.1 ; v2(17.98,11.33) 17.98,12.84 17.97,12.85 17.97,15.34 U2.2 ; v2(2.75,11.33) 2.75,12.84 2.73,12.85 2.73,15.34 U3.2 ; U5.2 40.85,15.35 40.85,12.85 40.85,12.85 v2(40.85,11.33) ; v2(33.22,11.33) 33.22,12.84 33.23,12.85 33.23,15.36 U8.2 ; v2(10.35,11.33) 10.35,12.85 10.36,12.85 10.36,15.34 U4.2 ; 9.86,2.95 11.64,2.95 13.92,5.23 14.18,5.23 ; 14.18,5.23 11.64,7.77 9.86,7.77 ; 14.18,5.23 TV1.5 18.24,5.23 18.24,7.62 23.99,7.62 24.26,7.36 24.26,11.25 v2(24.34,11.33) ; v2(25.61,11.33) 25.61,12.84 25.62,12.85 25.62,15.36 U6.2
  Bottom Layer w1: v2(48.47,11.33) v2(40.85,11.33) v2(33.22,11.33) v2(25.61,11.33) v2(24.34,11.33) v2(17.98,11.33) v2(10.35,11.33) v2(2.75,11.33)
USBD+: length 48
  Top Layer w0.3: v1(15.65,4.01) 16.07,4.01 16.35,4.28 TV1.6 ; TV1.1 20.56,4.28 v1(20.83,4.02) ; USBC1.A6 8.99,5.66 9.4,5.26 9.4,5.07 8.99,4.66 USBC1.B6
  Bottom Layer w0.3: v1(9.4,5.18) 10.59,5.18 10.88,5.48 11.43,5.48 11.43,4.37 11.08,4.02 11.08,3.56 11.48,3.15 12.45,3.15 13.31,4.02 14.18,4.02 14.48,4.32 15.35,4.32 15.65,4.02 v1(15.65,4.01) 20.82,4.01 v1(20.83,4.02) 21.3,4.49 U1.1
USBD-: length 47.6
  Top Layer w0.3: TV1.4 16.34,6.19 16.07,6.45 v1(15.65,6.45) ; 6.34,5.69 6.32,5.67 6.32,5.66 6.81,5.16 7.82,5.16 ; 6.34,5.69 6.81,6.16 7.82,6.16 ; 6.34,5.69 v1(6.4,5.69) ; v1(20.83,6.45) 20.56,6.19 TV1.3
  Bottom Layer w0.3: U1.2 47.54,6.45 v1(20.83,6.45) v1(15.65,6.45) 10.87,6.45 10.48,6.06 6.77,6.06 v1(6.4,5.69)
$1N557: length 7.5
  Top Layer w0.3: USBC1.A5 v1(9.6,6.66) ; v1(12.91,8.79) R2.1
  Bottom Layer w0.3: v1(12.91,8.79) 11.73,8.79 v1(9.6,6.66)
$1N558: length 8
  Top Layer w0.3: v1(9.35,3.96) 9.05,3.66 USBC1.B5 ; R1.1 14.34,1.07 v1(12.19,1.07)
  Bottom Layer w0.3: v1(9.35,3.96) 12.19,1.12 v1(12.19,1.07)

## Copper pours and planes (outline as drawn; the poured copper is in the pictures)
GND on Top Layer: -0.05,21.59 53.8,21.59 53.8,-0.02 -0.05,-0.02
GND on Bottom Layer: -0.21,21.49 53.8,21.49 53.8,0 -0.21,0
